# Altium schematic sheet X09-V2.0.0.SchDoc
size A3
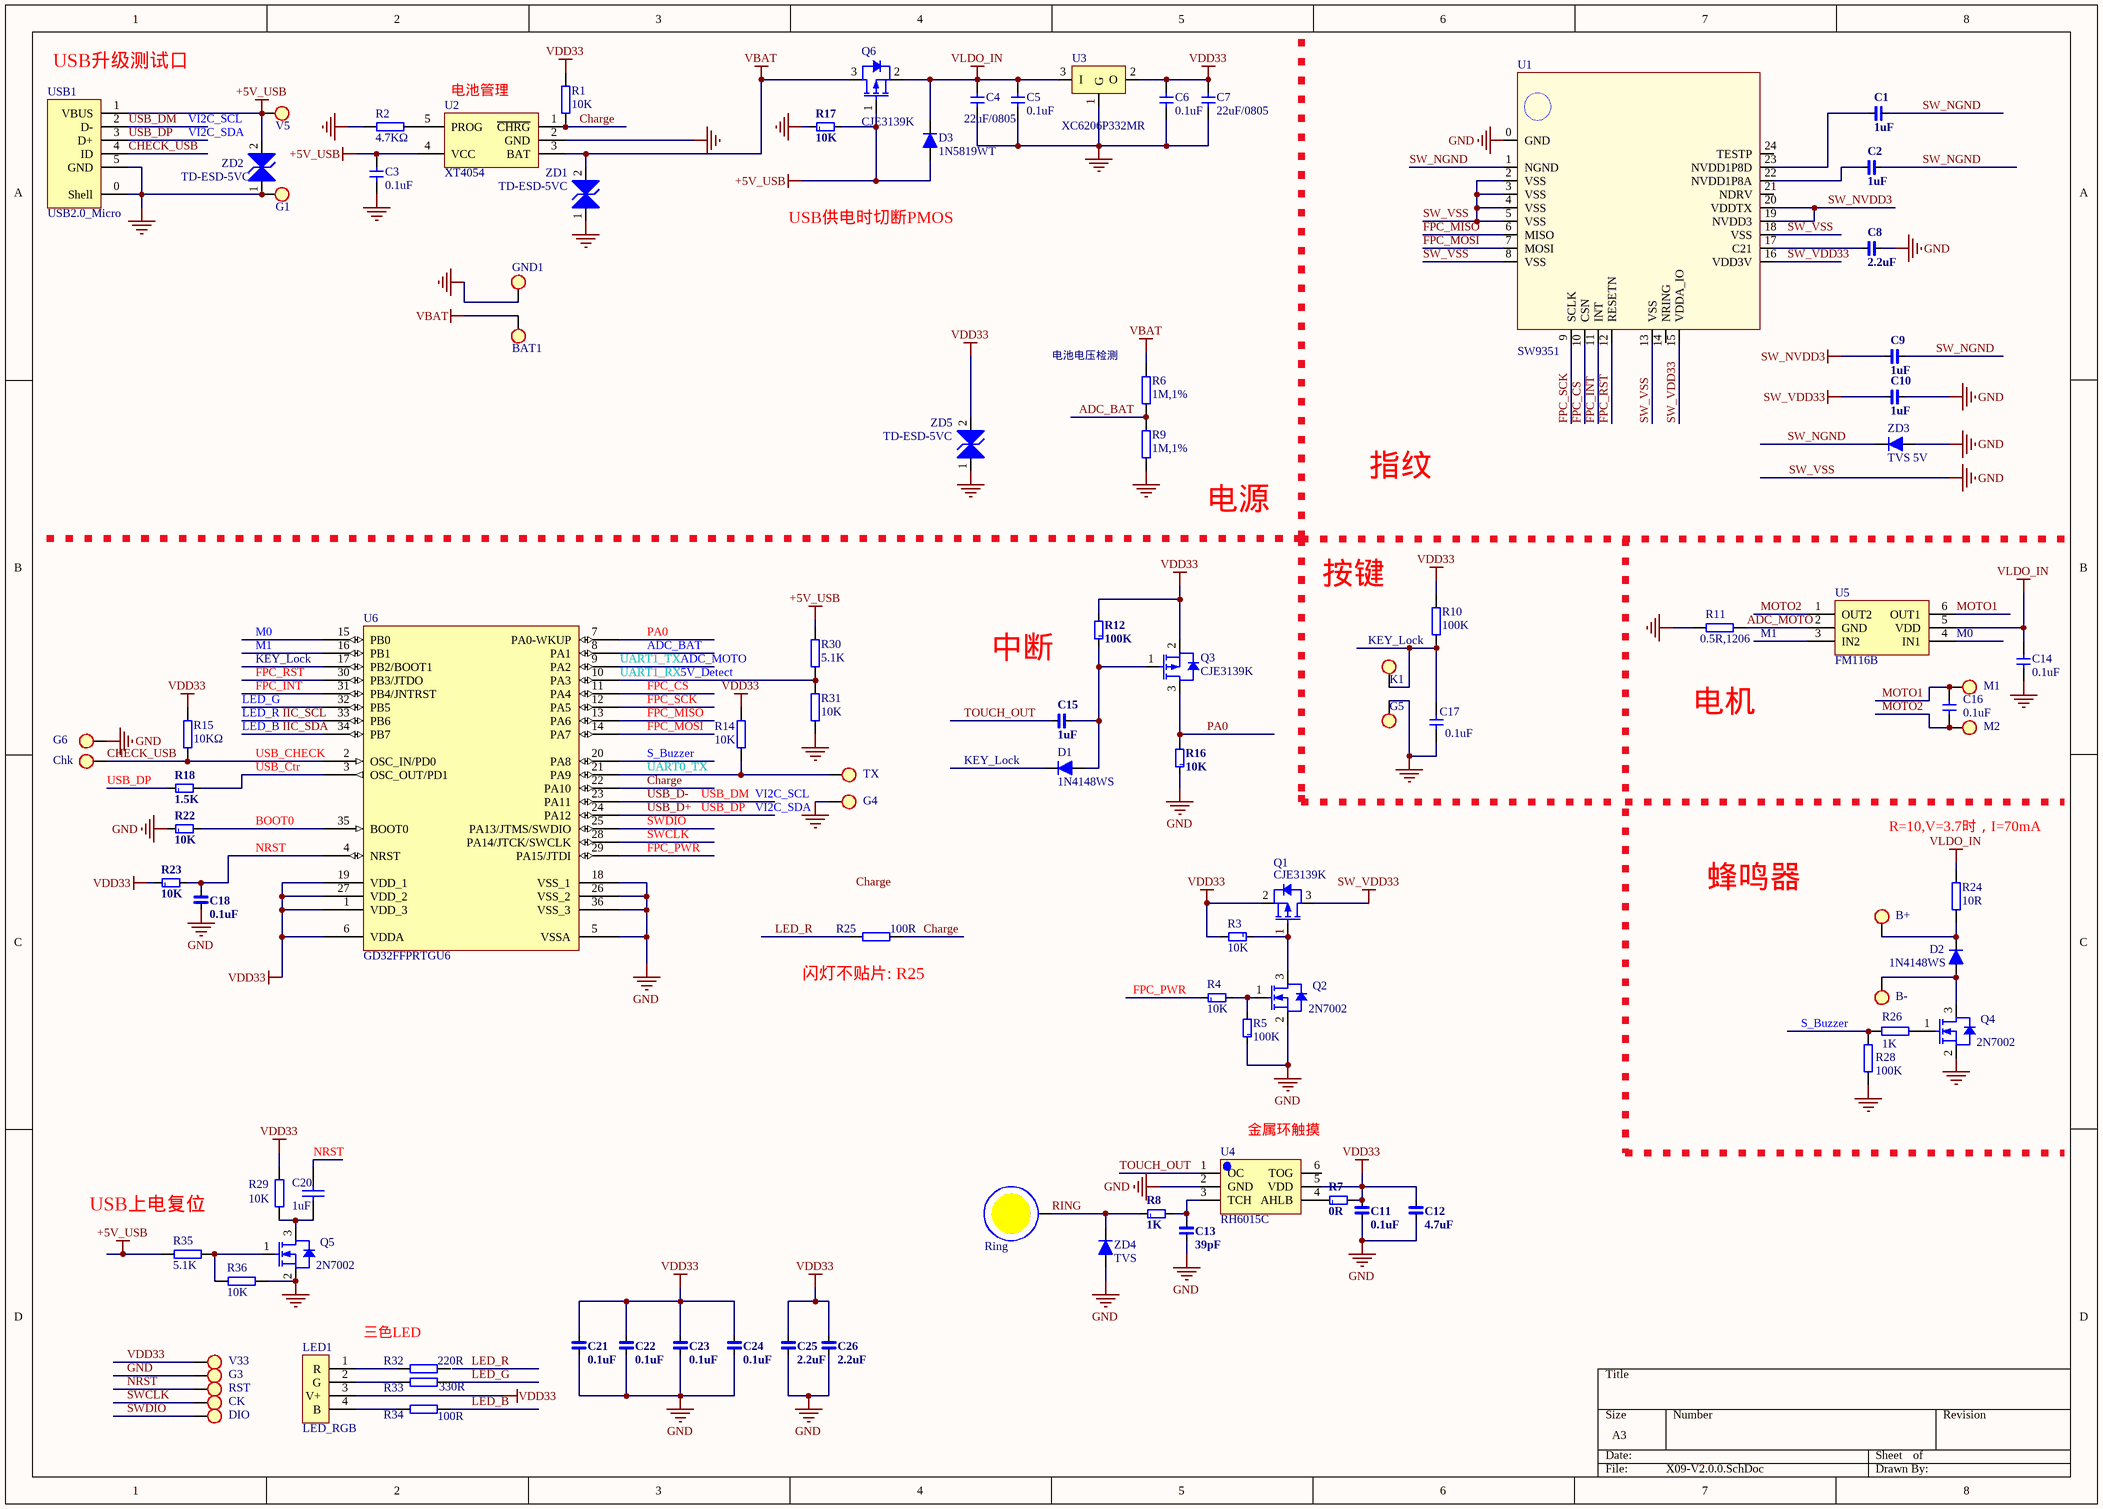
[diagram p0: X09-V2.0.0.SchDoc]

## Parts
B+  TestPoint  [TEST Point]  (value not drawn)
B-  TestPoint  [TEST Point]  (value not drawn)
BAT1  TestPoint  [TEST Point]  (value not drawn)
C1  1uF  [0402C]
C2  1uF  [0402C]
C3  0.1uF  [0402C]
C4  22uF/0805  [0603c]
C5  0.1uF  [0402C]
C6  0.1uF  [0402C]
C7  22uF/0805  [0603c]
C8  2.2uF  [0402C]
C9  1uF  [0402C]
C10  1uF  [0402C]
C11  0.1uF  [0402C]
C12  4.7uF  [0402C]
C13  39pF  [0402C]
C14  0.1uF  [0402C]
C15  1uF  [0402C]
C16  0.1uF  [0402C]
C17  0.1uF  [0402C]
C18  0.1uF  [0402C]
C20  1uF  [0402C]
C21  0.1uF  [0402C]
C22  0.1uF  [0402C]
C23  0.1uF  [0402C]
C24  0.1uF  [0402C]
C25  2.2uF  [0402C]
C26  2.2uF  [0402C]
Chk  TestPoint  [TEST Point]  (value not drawn)
CK  TestPoint  [TEST Point]  (value not drawn)
D1  1N4148WS  [SOD-523]
D2  1N4148WS  [SOD-523]
D3  1N5819WT  [SOD-523]
DIO  TestPoint  [TEST Point]  (value not drawn)
G1  TestPoint  [TEST Point]  (value not drawn)
G3  TestPoint  [TEST Point]  (value not drawn)
G4  TestPoint  [TEST Point]  (value not drawn)
G5  TestPoint  [TEST Point]  (value not drawn)
G6  TestPoint  [TEST Point]  (value not drawn)
GND1  TestPoint  [TEST Point]  (value not drawn)
K1  TestPoint  [TEST Point]  (value not drawn)
LED1  LED_RGB  [LED0603_RGB]
M1  TestPoint  [TEST Point]  (value not drawn)
M2  TestPoint  [TEST Point]  (value not drawn)
Q1  CJE3139K  [SOT-523]
Q2  2N7002  [SOT-523]
Q3  CJE3139K  [SOT-523]
Q4  2N7002  [SOT-523]
Q5  2N7002  [SOT-523]
Q6  CJE3139K  [SOT-523]
R1  10K  [0402R]
R2  4.7KΩ  [0402R]
R3  10K  [0402R]
R4  10K  [0402R]
R5  100K  [0402R]
R6  1M,1%  [0402R]
R7  0R  [0402R]
R8  1K  [0402R]
R9  1M,1%  [0402R]
R10  100K  [0402R]
R11  0.5R,1206  [1206]
R12  100K  [0402R]
R14  10K  [0402R]
R15  10KΩ  [0402R]
R16  10K  [0402R]
R17  10K  [0402R]
R18  1.5K  [0402R]
R22  10K  [0402R]
R23  10K  [0402R]
R24  10R  [0402R]
R25  100R  [0402R]
R26  1K  [0402R]
R28  100K  [0402R]
R29  10K  [0402R]
R30  5.1K  [0402R]
R31  10K  [0402R]
R32  220R  [0402R]
R33  330R  [0402R]
R34  100R  [0402R]
R35  5.1K  [0402R]
R36  10K  [0402R]
Ring  TouchKey  [TouchPad]  (value not drawn)
RST  TestPoint  [TEST Point]  (value not drawn)
TX  TestPoint  [TEST Point]  (value not drawn)
U1  SW9351  [SW9551L_1]
U2  XT4054  [LC-SOT-23-5]
U3  1ERP_VALUE: XC6206P332MR  [SOT-23-standard]  (hidden comment: XC6206P332MR-G)
U4  RH6015C  [LC-SOT-23-6]
U5  FM116B  [LC-SOT-23-6]
U6  GD32FFPRTGU6  [GD32GU6-TOP]
USB1  USB2.0_Micro  [USB2.0_Micro]
V5  TestPoint  [TEST Point]  (value not drawn)
V33  TestPoint  [TEST Point]  (value not drawn)
ZD1  TD-ESD-5VC  [SOD-523]
ZD2  TD-ESD-5VC  [SOD-523]
ZD3  TVS 5V  [SOD-523]
ZD4  TVS  [SOD-523]
ZD5  TD-ESD-5VC  [SOD-523]

## Nets
+5V_USB: C3.1 D3.1(A) Q6.1(G) R17.2 R30.1 R35.2 U2.4(VCC) USB1.1(VBUS) V5.1(Test) ZD2.2(A)
GND: C3.2 C4.2 C5.2 C6.2 C7.2 C8.1 C10.1 C11.1 C12.1 C13.1 C14.1 C17.2 C18.1 C21.1 C22.1 C23.1 C24.1 C25.1 C26.1 G1.1(Test) G3.1(Test) G4.1(Test) G5.1(Test) G6.1(Test) GND1.1(Test) Q2.2(S) Q4.2(S) Q5.2(S) R2.1 R5.1 R9.2 R11.1 R16.1 R17.1 R22.1 R28.2 R31.2 R36.2 U1.0(GND) U1.2(VSS) U1.3(VSS) U1.4(VSS) U1.5(VSS) U1.8(VSS) U1.13(VSS) U1.18(VSS) U2.2(GND) U3.1(G) U4.2(GND) U6.5(VSSA) U6.18(VSS_1) U6.26(VSS_2) U6.36(VSS_3) USB1.0(Shell) USB1.5(GND) ZD1.1(K) ZD2.1(K) ZD3.1(A) ZD4.1(A) ZD5.1(K)  [also labelled SW_VSS]
SW_NVDD3: C9.2 U1.19(NVDD3) U1.20(VDDTX)
SW_VDD33: C10.2 Q1.3(D) U1.15(VDDA_IO) U1.16(VDD3V)
VBAT: BAT1.1(Test) Q6.3(D) R6.1 U2.3(BAT) ZD1.2(A)
VDD33: C6.1 C7.1 C11.2 C12.2 C21.2 C22.2 C23.2 C24.2 C25.2 C26.2 LED1.3(V+) Q1.2(S) Q3.2(S) R1.1 R3.2 R7.2 R10.1 R12.2 R14.1 R15.2 R23.1 R29.1 U3.2(O) U4.5(VDD) U6.1(VDD_3) U6.6(VDDA) U6.19(VDD_1) U6.27(VDD_2) V33.1(Test) ZD5.2(A)
VLDO_IN: C4.1 C5.1 C14.2 D3.2(K) Q6.2(S) R24.2 U3.3(I) U5.5(VDD)
5V_Detect: R30.2 R31.1 U6.10(PA3)  [also labelled UART1_RX]
ADC_BAT: R6.2 R9.1 U6.8(PA1)
ADC_MOTO: R11.2 U5.2(GND) U6.9(PA2)  [also labelled UART1_TX]
BOOT0: R22.2 U6.35(BOOT0)
Charge: R1.2 R25.1 U2.1(~{CHRG}) U6.22(PA10)
CHECK_USB: Chk.1(Test) R15.1 U6.2(OSC_IN/PD0) USB1.4(ID)  [also labelled USB_CHECK]
FPC_CS: U1.10(CSN) U6.11(PA4)
FPC_INT: U1.11(INT) U6.31(PB4/JNTRST)
FPC_MISO: U1.6(MISO) U6.13(PA6)
FPC_MOSI: U1.7(MOSI) U6.14(PA7)
FPC_PWR: R4.1 U6.29(PA15/JTDI)
FPC_RST: U1.12(RESETN) U6.30(PB3/JTDO)
FPC_SCK: U1.9(SCLK) U6.12(PA5)
IIC_SCL: R25.2 U6.33(PB6)  [also labelled LED_R]
IIC_SDA: R34.1 U6.34(PB7)  [also labelled LED_B]
KEY_Lock: C17.1 D1.2(K) K1.1(Test) R10.2 U6.17(PB2/BOOT1)
LED_G: R33.1 U6.32(PB5)
M0: U5.4(IN1) U6.15(PB0)
M1: U5.3(IN2) U6.16(PB1)
MOTO1: C16.2 M1.1(Test) U5.6(OUT1)
MOTO2: C16.1 M2.1(Test) U5.1(OUT2)
NRST: C18.2 C20.1 R23.2 RST.1(Test) U6.4(NRST)
PA0: Q3.3(D) R16.2 U6.7(PA0-WKUP)
RING: R8.1 Ring.1(Key) ZD4.2(K)
S_Buzzer: R26.2 R28.1 U6.20(PA8)
SW_NGND: C1.1 C2.1 C9.1 U1.1(NGND) ZD3.2(K)
SWCLK: CK.1(Test) U6.28(PA14/JTCK/SWCLK)
SWDIO: DIO.1(Test) U6.25(PA13/JTMS/SWDIO)
TOUCH_OUT: C15.2 U4.1(OC)
UART0_TX: R14.2 TX.1(Test) U6.21(PA9)
USB_Ctr: R18.2 U6.3(OSC_OUT/PD1)
USB_D+: R18.1 U6.24(PA12) USB1.3(D+)  [also labelled USB_DP, VI2C_SDA]
USB_D-: U6.23(PA11) USB1.2(D-)  [also labelled USB_DM, VI2C_SCL]
NetB+_1: B+.1(Test) D2.2(K) R24.1
NetB-_1: B-.1(Test) D2.1(A) Q4.3(D)
NetC1_2: C1.2 U1.23(NVDD1P8D)
NetC2_2: C2.2 U1.22(NVDD1P8A)
NetC8_2: C8.2 U1.17(C21)
NetC13_2: C13.2 R8.2 U4.3(TCH)
NetC15_1: C15.1 D1.1(A) Q3.1(G) R12.1
NetC20_2: C20.2 Q5.3(D) R29.2
NetLED1_1: LED1.1(R) R32.2
NetLED1_2: LED1.2(G) R33.2
NetLED1_4: LED1.4(B) R34.2
NetQ1_1: Q1.1(G) Q2.3(D) R3.1
NetQ2_1: Q2.1(G) R4.2 R5.2
NetQ4_1: Q4.1(G) R26.1
NetQ5_1: Q5.1(G) R35.1 R36.1
NetR2_2: R2.2 U2.5(PROG)
NetR7_1: R7.1 U4.4(AHLB)

Not connected (* = marked no-connect by the designer): R32 1; U1 14(NRING) 21(NDRV) 24(TESTP); U4 6(TOG)

## Notes on the sheet
- (near USB1) USB升级测试口
- (near U2) 电池管理
- USB供电时切断PMOS
- 电池电压检测
- 电源
- 指纹
- 按键
- 中断
- 电机
- (near R24) R=10,V=3.7时，I=70mA
- 蜂鸣器
- (near R25) 闪灯不贴片: R25
- (near U4) 金属环触摸
- (near R35) USB上电复位
- 三色LED
- Labels drawn without touching a wire or pin: Charge

## Library data of the parts
C1 C2 C8-C13 C15 C18 C21-C26 = CAP_0402A: Capacitor
C3-C7 C14 C16 C17 = CAP: Capacitor
C20 = 50V/0.1uF: 表贴电容
D1-D3 ZD3 ZD4 = DIODE
Q1 Q3 Q6 = MOSFET-P: P-Channel MOSFET; Published: 8-Jun-2000; LatestRevisionDate: 17-Jul-2002; LatestRevisionNote: Re-released for DXP Platform.; PackageVersion: 1995/1996; PackageReference: E3; Publisher: Altium Limited
Q2 Q4 Q5 = MOSFET-N: N-Channel MOSFET; Published: 8-Jun-2000; LatestRevisionDate: 17-Jul-2002; LatestRevisionNote: Re-released for DXP Platform.; PackageVersion: 1995/1996; PackageReference: E3; Publisher: Altium Limited; PackageDescription: TO, Flat Index; 3 In-Line, Axial Leads; Body Dia. 4.6mm; Lead Dia. 0.5 mm (max)
R1 R2 R6 R9-R11 R14 R15 R25 R26 R28-R36 = 10KΩ: 直插/表贴电阻
R3-R5 = RES_0603A: Resistor
R7 R8 R12 R16-R18 R22 R23 = RES_0402A: Resistor
R24 = RES2
U1 = SW9551_120
U2 = 4054: 电池管理芯片
U3 = XC6206P182MR-G: 电源IC; 1ERP_CODE: 1.04.003.0015; 1ERP_INDEX: AG132; ISSMD: Y
U4 = RH6015C: 单通道触摸IC,SOT23-6; 1ERP_CODE: 1.04.011.0005; 1ERP_INDEX: AG076-A01; ISSMD: Y
U5 = FM116B: 电机驱动
USB1 = USB2.0_Mini_Micro
ZD1 ZD2 ZD5 = TVS-DUAL